# Altium schematic sheet TFT Display.SchDoc
size A; SheetNumber: 8; SheetTotal: 14
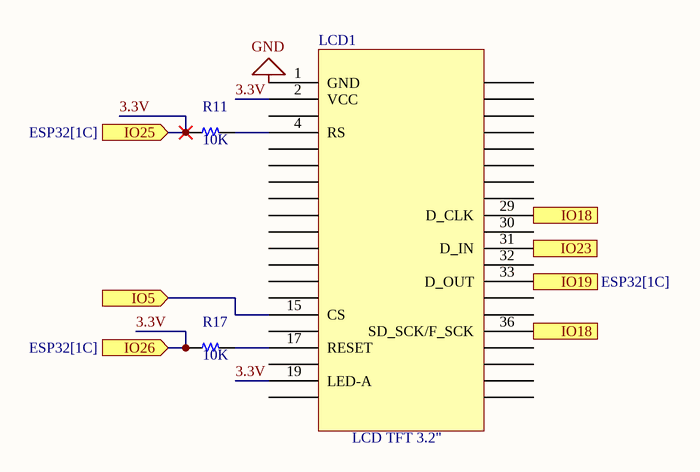
[diagram p0: TFT Display.SchDoc]

## Parts
LCD1  LCD TFT 3.2"  [LCD TFT 3.2"]
R11  10K  [R 0805]
R17  10K  [R 0805]

## Ports
IO5 (in, see ESP32[1B]), IO18 (in, see ESP32[1B]), IO19 (in, see ESP32[1C]), IO23 (in, see ESP32[1C]), IO25 (in, see ESP32[1C]), IO26 (in, see ESP32[1C])

## Nets
GND: LCD1.1(GND)
3.3V: LCD1.2(VCC) LCD1.19(LED-A) R11.1 R17.1 ; port IO26, port IO25
IO5: LCD1.15(CS) ; port IO5
IO18: LCD1.29(D_CLK) LCD1.36(SD_SCK/F_SCK) ; port IO18
IO19: LCD1.33(D_OUT) ; port IO19
IO23: LCD1.31(D_IN) ; port IO23
NetLCD1_4: LCD1.4(RS) R11.2
NetLCD1_17: LCD1.17(RESET) R17.2

Not connected (* = marked no-connect by the designer): LCD1 3(NC) 5(WR) 6(RD) 7(DB8) 8(DB9) 9(DB10) 10(DB11) 11(DB12) 12(DB13) 13(DB14) 14(DB15) 16(F_CS) 18(NC) 20(NC) 21(DB0) 22(DB1) 23(DB2) 24(DB3) 25(DB4) 26(DB5) 27(DB6) 28(DB7) 30(D_CS) 32(D_BUSY) 34(D_Penirg) 35(SD_OUT/F_SI) 37(SD_DIN/F_SO) 38(SD_CS) 39(F_WP) 40(F_HOLD)

## Library data of the parts
LCD1 = LCD TFT 3.2": LCD TFT
R11 R17 = Resistor